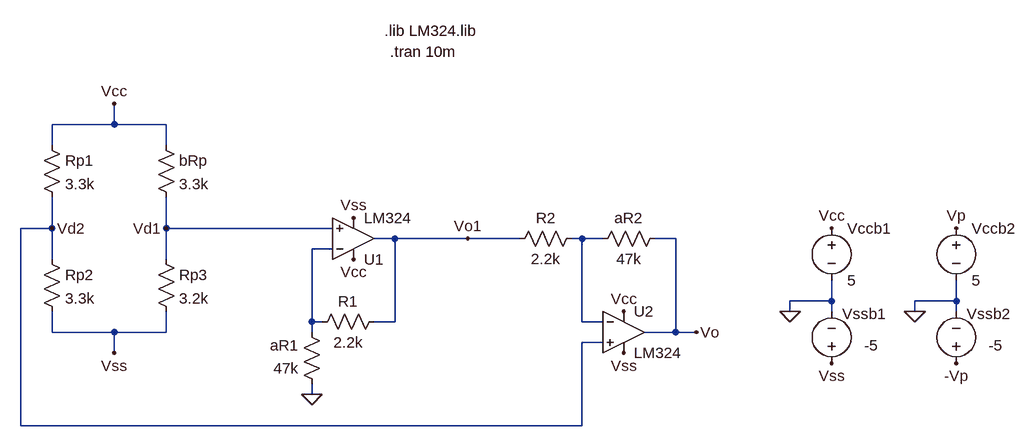
[diagram p0: schematic circuito2lab2.asc]
circuito2lab2.asc, the LTspice schematic file:
Version 4
SHEET 1 880 680
WIRE -704 -96 -704 -128
WIRE -704 -96 -800 -96
WIRE -624 -96 -704 -96
WIRE -800 -64 -800 -96
WIRE -624 -64 -624 -96
WIRE -800 64 -800 16
WIRE -800 64 -848 64
WIRE -624 64 -624 16
WIRE -368 64 -624 64
WIRE -272 80 -304 80
WIRE -160 80 -272 80
WIRE -80 80 -160 80
WIRE 16 80 0 80
WIRE 48 80 16 80
WIRE 160 80 128 80
WIRE -368 96 -400 96
WIRE -800 112 -800 64
WIRE -624 112 -624 64
WIRE 400 176 400 144
WIRE 400 176 336 176
WIRE 592 176 592 144
WIRE 592 176 528 176
WIRE 336 192 336 176
WIRE 400 192 400 176
WIRE 528 192 528 176
WIRE 592 192 592 176
WIRE -400 208 -400 96
WIRE -384 208 -400 208
WIRE -272 208 -272 80
WIRE -272 208 -304 208
WIRE 16 208 16 80
WIRE 48 208 16 208
WIRE -800 224 -800 192
WIRE -704 224 -800 224
WIRE -624 224 -624 192
WIRE -624 224 -704 224
WIRE -400 224 -400 208
WIRE 160 224 160 80
WIRE 160 224 112 224
WIRE 192 224 160 224
WIRE 48 240 16 240
WIRE -704 256 -704 224
WIRE -400 320 -400 304
WIRE -848 368 -848 64
WIRE 16 368 16 240
WIRE 16 368 -848 368
FLAG 336 192 0
FLAG 400 64 Vcc
FLAG 400 272 Vss
FLAG 80 256 Vss
FLAG 80 192 Vcc
FLAG 192 224 Vo
FLAG -336 48 Vss
FLAG -336 112 Vcc
FLAG -400 320 0
FLAG -624 64 Vd1
FLAG -800 64 Vd2
FLAG 528 192 0
FLAG 592 64 Vp
FLAG 592 272 -Vp
FLAG -160 80 Vo1
FLAG -704 -128 Vcc
FLAG -704 256 Vss
SYMBOL voltage 400 48 R0
WINDOW 123 0 0 Left 0
WINDOW 39 0 0 Left 0
SYMATTR InstName Vccb1
SYMATTR Value 5
SYMBOL voltage 400 288 R180
WINDOW 123 0 0 Left 0
WINDOW 39 0 0 Left 0
WINDOW 0 -83 92 Left 2
WINDOW 3 -72 44 Left 2
SYMATTR InstName Vssb1
SYMATTR Value -5
SYMBOL OpAmps\\opamp2 80 160 R0
SYMATTR InstName U2
SYMATTR Value LM324
SYMBOL res 144 64 R90
WINDOW 0 0 56 VBottom 2
WINDOW 3 32 56 VTop 2
SYMATTR InstName aR2
SYMATTR Value 47k
SYMBOL res 16 64 R90
WINDOW 0 0 56 VBottom 2
WINDOW 3 32 56 VTop 2
SYMATTR InstName R2
SYMATTR Value 2.2k
SYMBOL res -816 -80 R0
SYMATTR InstName Rp1
SYMATTR Value 3.3k
SYMBOL res -640 -80 R0
SYMATTR InstName bRp
SYMATTR Value 3.3k
SYMBOL res -640 96 R0
SYMATTR InstName Rp3
SYMATTR Value 3.2k
SYMBOL res -816 96 R0
SYMATTR InstName Rp2
SYMATTR Value 3.3k
SYMBOL OpAmps\\opamp2 -336 144 M180
SYMATTR InstName U1
SYMATTR Value LM324
SYMBOL res -288 192 R90
WINDOW 0 0 56 VBottom 2
WINDOW 3 32 56 VTop 2
SYMATTR InstName R1
SYMATTR Value 2.2k
SYMBOL res -384 320 R180
WINDOW 0 36 76 Left 2
WINDOW 3 36 40 Left 2
SYMATTR InstName aR1
SYMATTR Value 47k
SYMBOL voltage 592 48 R0
WINDOW 123 0 0 Left 0
WINDOW 39 0 0 Left 0
SYMATTR InstName Vccb2
SYMATTR Value 5
SYMBOL voltage 592 288 R180
WINDOW 123 0 0 Left 0
WINDOW 39 0 0 Left 0
WINDOW 0 -83 92 Left 2
WINDOW 3 -72 44 Left 2
SYMATTR InstName Vssb2
SYMATTR Value -5
TEXT -288 -240 Left 2 !.lib LM324.lib
TEXT -280 -208 Left 2 !.tran 10m

The netlist it stands for:
* circuito2lab2.asc
Vccb1 Vcc 0 5
Vssb1 Vss 0 -5
XU2 Vd2 N001 Vcc Vss Vo LM324  ; pins In+ In- V+ V- OUT
R§aR2 Vo N001 47k
R2 N001 Vo1 2.2k
Rp1 Vcc Vd2 3.3k
R§bRp Vcc Vd1 3.3k
Rp3 Vd1 Vss 3.2k
Rp2 Vd2 Vss 3.3k
XU1 Vd1 N002 Vcc Vss Vo1 LM324  ; pins In+ In- V+ V- OUT
R1 Vo1 N002 2.2k
R§aR1 0 N002 47k
Vccb2 Vp 0 5
Vssb2 -Vp 0 -5
.lib LM324.lib
.tran 10m
.backanno
.end